# EAGLE board jb-main (EAGLE 4.15), part 1 of 2
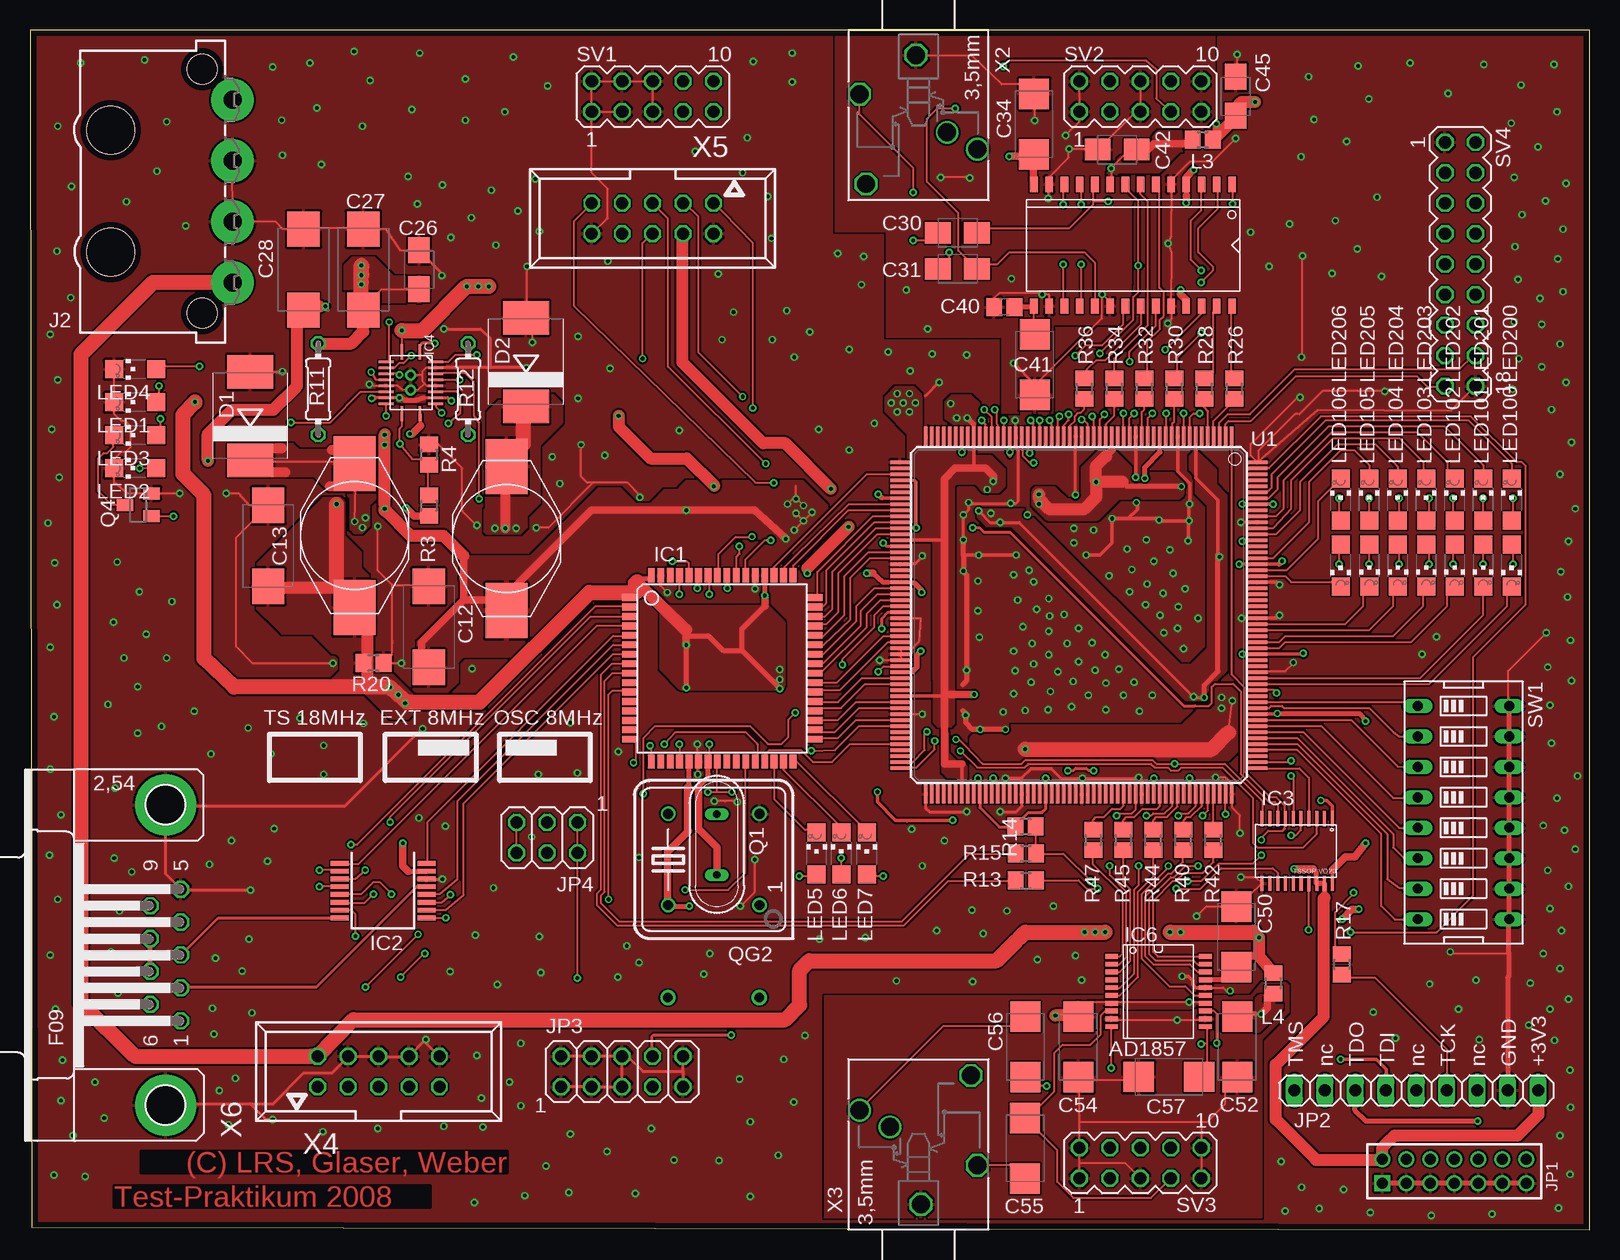
[diagram p7: board, top side]
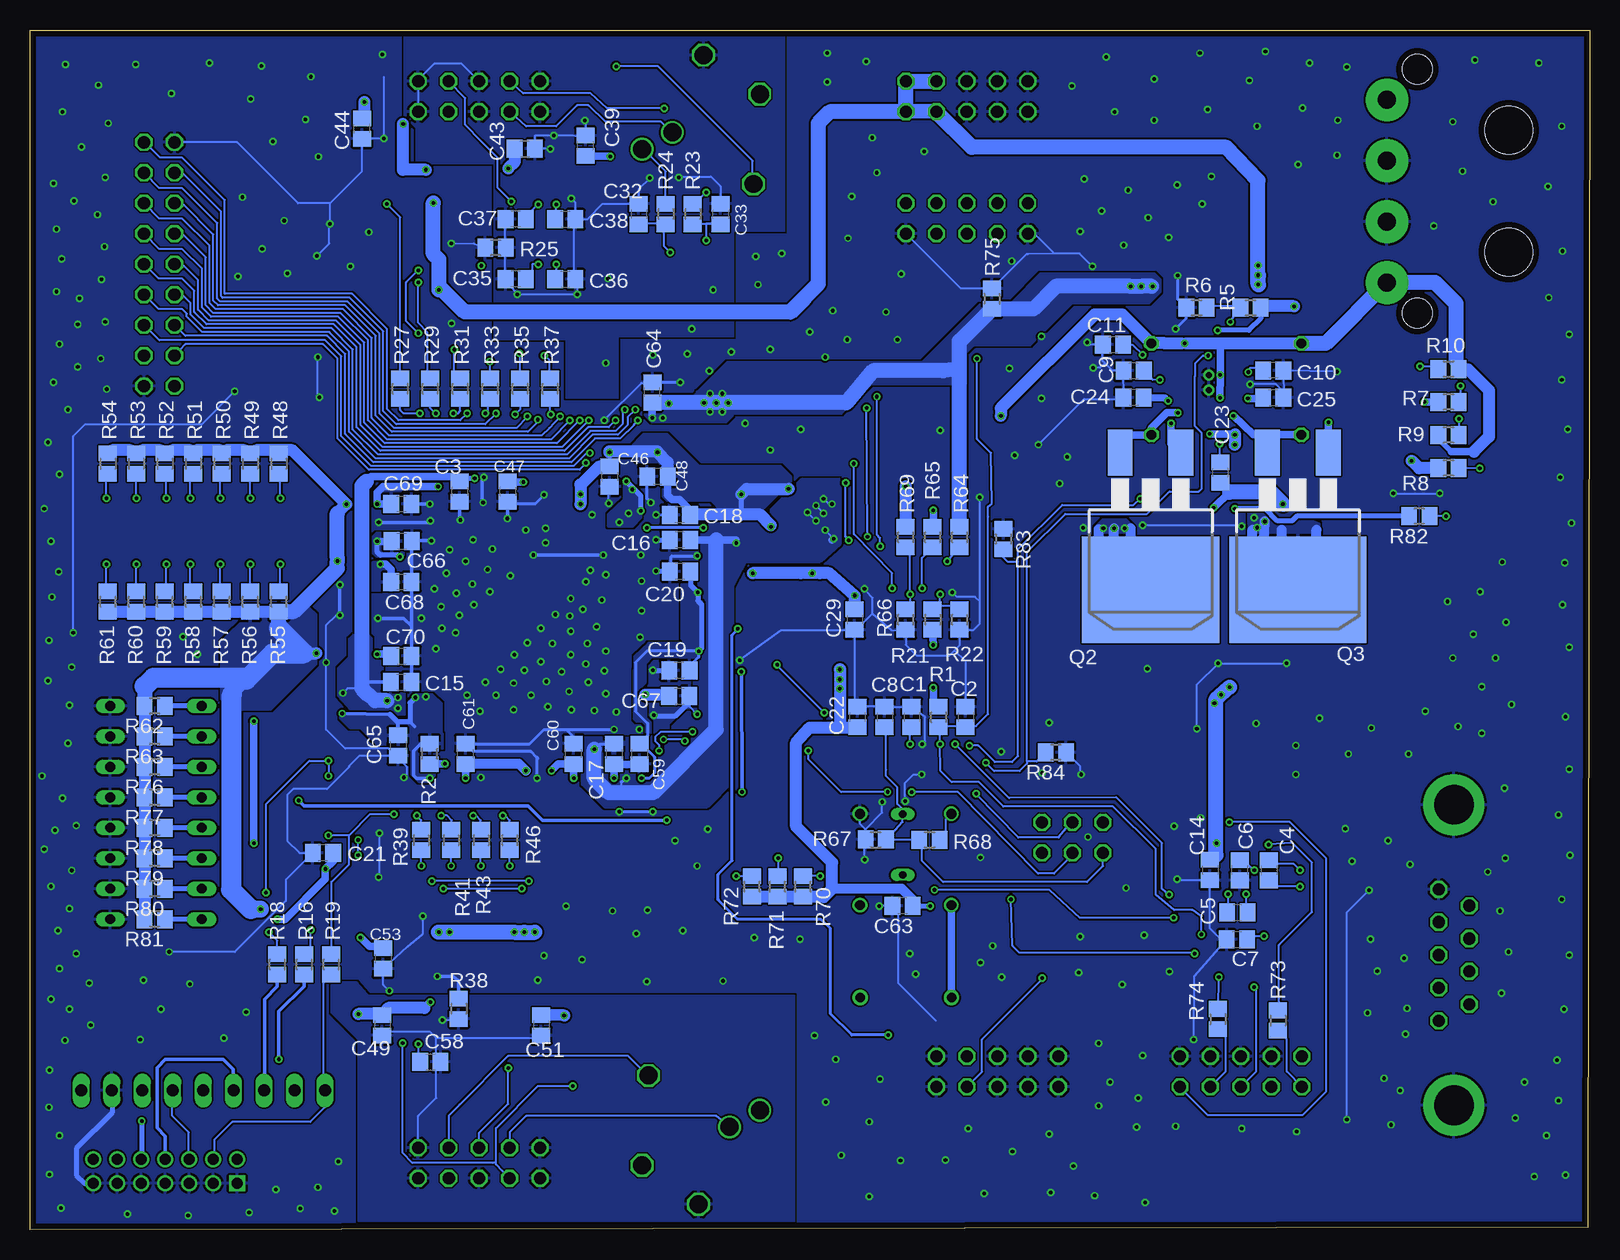
[diagram p8: board, bottom side, seen from below]

Size 130 x 100 mm. Coordinates in mm from the lower left corner, seen from the top.
Outline: 0.13,0.19 130,0 130,100 0,100 0.13,0.19
Copper layers (1*16): Top 0.035mm / dielectric 1.5mm / Bottom 0.035mm
Design rules "PCB-POOL": minimum track width 6mil, minimum drill 12mil, track to track 6mil, track to pad 6mil, pad to pad 6mil, via to via 6mil, smd to smd 6mil, copper to edge 20mil, drill to drill 8mil, minimum pad ring 8mil, minimum via ring 6mil, stop-mask expansion 3mil, vias tented up to drill 12mil, thermal gap 8mil

## Footprints (pad centres in the part's own frame; a part is rotated, then mirrored left to right if it is on the bottom)
C0805 = smd 1.3 x 1.5: 1 -0.85,0; 2 0.85,0
D/7343-31W = smd 2.95 x 2.7: + 3.375,0; - -3.375,0
B/3528-21W = smd 2.15 x 1.8: + 1.625,0; - -1.625,0
C/6032-28R = smd 2.55 x 2.5: + 2.525,0; - -2.525,0
SMC = smd 2.8 x 3.8: A 3.7,0; C -3.7,0
TQFP64 = smd 1.194 x 0.559: 1 -7.76,5.905; 2 -7.76,5.118; 3 -7.76,4.331; 4 -7.76,3.543; 5 -7.76,2.756; 6 -7.76,1.968; 7 -7.76,1.181; 8 -7.76,0.394; 9 -7.76,-0.394; 10 -7.76,-1.181; 11 -7.76,-1.968; 12 -7.76,-2.756; 13 -7.76,-3.543; 14 -7.76,-4.331; 15 -7.76,-5.118; 16 -7.76,-5.905; 33 7.76,-5.905; 34 7.76,-5.118; 35 7.76,-4.331; 36 7.76,-3.543; 37 7.76,-2.756; 38 7.76,-1.968; 39 7.76,-1.181; 40 7.76,-0.394; 41 7.76,0.394; 42 7.76,1.181; 43 7.76,1.968; 44 7.76,2.756; 45 7.76,3.543; 46 7.76,4.331; 47 7.76,5.118; 48 7.76,5.905 | smd 0.559 x 1.194: 17 -5.905,-7.76; 18 -5.118,-7.76; 19 -4.331,-7.76; 20 -3.543,-7.76; 21 -2.756,-7.76; 22 -1.968,-7.76; 23 -1.181,-7.76; 24 -0.394,-7.76; 25 0.394,-7.76; 26 1.181,-7.76; 27 1.968,-7.76; 28 2.756,-7.76; 29 3.543,-7.76; 30 4.331,-7.76; 31 5.118,-7.76; 32 5.905,-7.76; 49 5.905,7.76; 50 5.118,7.76; 51 4.331,7.76; 52 3.543,7.76; 53 2.756,7.76; 54 1.968,7.76; 55 1.181,7.76; 56 0.394,7.76; 57 -0.394,7.76; 58 -1.181,7.76; 59 -1.968,7.76; 60 -2.756,7.76; 61 -3.543,7.76; 62 -4.331,7.76; 63 -5.118,7.76; 64 -5.905,7.76
SSOP16 = smd 0.4 x 1.5: 1 -2.275,-3.625; 2 -1.625,-3.625; 3 -0.975,-3.625; 4 -0.325,-3.625; 5 0.325,-3.625; 6 0.975,-3.625; 7 1.625,-3.625; 8 2.275,-3.625; 9 2.275,3.625; 10 1.625,3.625; 11 0.975,3.625; 12 0.325,3.625; 13 -0.325,3.625; 14 -0.975,3.625; 15 -1.625,3.625; 16 -2.275,3.625
VO20 = smd 0.254 x 1.27: 1 2.928,2.701; 2 2.276,2.7; 3 1.626,2.7; 4 0.977,2.701; 5 0.325,2.7; 6 -0.325,2.7; 7 -0.975,2.7; 8 -1.626,2.7; 9 -2.276,2.7; 10 -2.926,2.7; 11 -2.928,-2.7; 12 -2.28,-2.7; 13 -1.623,-2.7; 14 -0.975,-2.7; 15 -0.328,-2.7; 16 0.328,-2.7; 17 0.975,-2.71; 18 1.623,-2.7; 19 2.28,-2.7; 20 2.928,-2.7
R-PQFP-20 = smd 1.27 x 0.203: 1 -7.317,1.5; 10 -2.183,1.5; 11 -2.183,3; 20 -7.317,3 | smd 0.203 x 1.27: 2 -6.5,0.182; 3 -6,0.182; 4 -5.5,0.182; 5 -5,0.182; 6 -4.5,0.182; 7 -4,0.182; 8 -3.5,0.182; 9 -3,0.182; 12 -3,4.317; 13 -3.5,4.317; 14 -4,4.317; 15 -4.5,4.317; 16 -5,4.317; 17 -5.5,4.317; 18 -6,4.317; 19 -6.5,4.317 | drill 0.5 round: TGND1 -5.385,2.226; TGND2 -4.135,2.226
R-28 = smd 1.27 x 0.635: 1 -5.08,8.255; 2 -5.08,6.985; 3 -5.08,5.715; 4 -5.08,4.445; 5 -5.08,3.175; 6 -5.08,1.905; 7 -5.08,0.635; 8 -5.08,-0.635; 9 -5.08,-1.905; 10 -5.08,-3.175; 11 -5.08,-4.445; 12 -5.08,-5.715; 13 -5.08,-6.985; 14 -5.08,-8.255; 15 5.08,-8.255; 16 5.08,-6.985; 17 5.08,-5.715; 18 5.08,-4.445; 19 5.08,-3.175; 20 5.08,-1.905; 21 5.08,-0.635; 22 5.08,0.635; 23 5.08,1.905; 24 5.08,3.175; 25 5.08,4.445; 26 5.08,5.715; 27 5.08,6.985; 28 5.08,8.255
RS-20 = smd 1.067 x 0.406: 1 -3.901,2.926; 2 -3.901,2.276; 3 -3.901,1.626; 4 -3.901,0.975; 5 -3.901,0.325; 6 -3.901,-0.325; 7 -3.901,-0.975; 8 -3.901,-1.626; 9 -3.901,-2.276; 10 -3.901,-2.926; 11 3.901,-2.926; 12 3.901,-2.276; 13 3.901,-1.626; 14 3.901,-0.975; 15 3.901,-0.325; 16 3.901,0.325; 17 3.901,0.975; 18 3.901,1.626; 19 3.901,2.276; 20 3.901,2.926
827001 = drill 1.5 pad 3.556 round: 1 -7.62,0; 2 -2.54,0; 3 2.54,0; 4 7.62,0 | hole 4: 5.08,-10.16; -5.08,-10.16 | hole 2.5: 10.16,-2.54; -10.16,-2.54
2X07M = drill 0.914 square: 1 -6,-1 | drill 0.914 round: 2 -6,1; 3 -4,-1; 4 -4,1; 5 -2,-1; 6 -2,1; 7 0,-1; 8 0,1; 9 2,-1; 10 2,1; 11 4,-1; 12 4,1; 13 6,-1; 14 6,1
1X09 = drill 1.016 long: 1 -10.16,0; 2 -7.62,0; 3 -5.08,0; 4 -2.54,0; 5 0,0; 6 2.54,0; 7 5.08,0; 8 7.62,0; 9 10.16,0
2X05 = drill 1.016 octagon: 1 -5.08,-1.27; 2 -5.08,1.27; 3 -2.54,-1.27; 4 -2.54,1.27; 5 0,-1.27; 6 0,1.27; 7 2.54,-1.27; 8 2.54,1.27; 9 5.08,-1.27; 10 5.08,1.27
2X03 = drill 1.016 octagon: 1 -2.54,-1.27; 2 -2.54,1.27; 3 0,-1.27; 4 0,1.27; 5 2.54,-1.27; 6 2.54,1.27
L-13X10 = smd 3.5 x 4.6: 1 0,6; 2 0,-6
R0805 = smd 1.3 x 1.5: 1 -0.85,0; 2 0.85,0
CHIPLED_1206 = smd 1.5 x 1.5: A 0,-1.75; C 0,1.75
QS = drill 0.61 long: 1 -2.54,0; 2 2.54,0
D2PACK = smd 2.083 x 3.81: 1 -2.54,-8.89; 3 2.54,-8.89 | smd 11.43 x 8.89: 2 0,2.54
SOT23 = smd 1 x 1.4: 1 -0.95,-1.1; 2 0.95,-1.1; 3 0,1.1
DIL08S = drill 0.813 round: 1 -3.81,-3.81; 4 3.81,-3.81; 5 3.81,3.81; 8 -3.81,3.81
0204/7 = drill 0.813 octagon: 1 -3.81,0; 2 3.81,0
MA05-2 = drill 1.016 octagon: 1 -5.08,-1.27; 2 -5.08,1.27; 3 -2.54,-1.27; 4 -2.54,1.27; 5 0,-1.27; 6 0,1.27; 7 2.54,-1.27; 8 2.54,1.27; 9 5.08,-1.27; 10 5.08,1.27
MA09-2 = drill 1.016 octagon: 1 -10.16,-1.27; 2 -10.16,1.27; 3 -7.62,-1.27; 4 -7.62,1.27; 5 -5.08,-1.27; 6 -5.08,1.27; 7 -2.54,-1.27; 8 -2.54,1.27; 9 0,-1.27; 10 0,1.27; 11 2.54,-1.27; 12 2.54,1.27; 13 5.08,-1.27; 14 5.08,1.27; 15 7.62,-1.27; 16 7.62,1.27; 17 10.16,-1.27; 18 10.16,1.27
EDG-08 = drill 0.813 long: 1 -8.89,-3.81; 2 -6.35,-3.81; 3 -3.81,-3.81; 4 -1.27,-3.81; 5 1.27,-3.81; 6 3.81,-3.81; 7 6.35,-3.81; 8 8.89,-3.81; 9 8.89,3.81; 10 6.35,3.81; 11 3.81,3.81; 12 1.27,3.81; 13 -1.27,3.81; 14 -3.81,3.81; 15 -6.35,3.81; 16 -8.89,3.81
PQ208 = smd 1.6 x 0.3: P1 -14.9,12.75; P2 -14.9,12.25; P3 -14.9,11.75; P4 -14.9,11.25; P5 -14.9,10.75; P6 -14.9,10.25; P7 -14.9,9.75; P8 -14.9,9.25; P9 -14.9,8.75; P10 -14.9,8.25; P11 -14.9,7.75; P12 -14.9,7.25; P13 -14.9,6.75; P14 -14.9,6.25; P15 -14.9,5.75; P16 -14.9,5.25; P17 -14.9,4.75; P18 -14.9,4.25; P19 -14.9,3.75; P20 -14.9,3.25; P21 -14.9,2.75; P22 -14.9,2.25; P23 -14.9,1.75; P24 -14.9,1.25; P25 -14.9,0.75; P26 -14.9,0.25; P27 -14.9,-0.25; P28 -14.9,-0.75; P29 -14.9,-1.25; P30 -14.9,-1.75; P31 -14.9,-2.25; P32 -14.9,-2.75; P33 -14.9,-3.25; P34 -14.9,-3.75; P35 -14.9,-4.25; P36 -14.9,-4.75; P37 -14.9,-5.25; P38 -14.9,-5.75; P39 -14.9,-6.25; P40 -14.9,-6.75; P41 -14.9,-7.25; P42 -14.9,-7.75; P43 -14.9,-8.25; P44 -14.9,-8.75; P45 -14.9,-9.25; P46 -14.9,-9.75; P47 -14.9,-10.25; P48 -14.9,-10.75; P49 -14.9,-11.25; P50 -14.9,-11.75; P51 -14.9,-12.25; P52 -14.9,-12.75; P105 14.9,-12.75; P106 14.9,-12.25; P107 14.9,-11.75; P108 14.9,-11.25; P109 14.9,-10.75; P110 14.9,-10.25; P111 14.9,-9.75; P112 14.9,-9.25; P113 14.9,-8.75; P114 14.9,-8.25; P115 14.9,-7.75; P116 14.9,-7.25; P117 14.9,-6.75; P118 14.9,-6.25; P119 14.9,-5.75; P120 14.9,-5.25; P121 14.9,-4.75; P122 14.9,-4.25; P123 14.9,-3.75; P124 14.9,-3.25; P125 14.9,-2.75; P126 14.9,-2.25; P127 14.9,-1.75; P128 14.9,-1.25; P129 14.9,-0.75; P130 14.9,-0.25; P131 14.9,0.25; P132 14.9,0.75; P133 14.9,1.25; P134 14.9,1.75; P135 14.9,2.25; P136 14.9,2.75; P137 14.9,3.25; P138 14.9,3.75; P139 14.9,4.25; P140 14.9,4.75; P141 14.9,5.25; P142 14.9,5.75; P143 14.9,6.25; P144 14.9,6.75; P145 14.9,7.25; P146 14.9,7.75; P147 14.9,8.25; P148 14.9,8.75; P149 14.9,9.25; P150 14.9,9.75; P151 14.9,10.25; P152 14.9,10.75; P153 14.9,11.25; P154 14.9,11.75; P155 14.9,12.25; P156 14.9,12.75 | smd 0.3 x 1.6: P53 -12.75,-14.9; P54 -12.25,-14.9; P55 -11.75,-14.9; P56 -11.25,-14.9; P57 -10.75,-14.9; P58 -10.25,-14.9; P59 -9.75,-14.9; P60 -9.25,-14.9; P61 -8.75,-14.9; P62 -8.25,-14.9; P63 -7.75,-14.9; P64 -7.25,-14.9; P65 -6.75,-14.9; P66 -6.25,-14.9; P67 -5.75,-14.9; P68 -5.25,-14.9; P69 -4.75,-14.9; P70 -4.25,-14.9; P71 -3.75,-14.9; P72 -3.25,-14.9; P73 -2.75,-14.9; P74 -2.25,-14.9; P75 -1.75,-14.9; P76 -1.25,-14.9; P77 -0.75,-14.9; P78 -0.25,-14.9; P79 0.25,-14.9; P80 0.75,-14.9; P81 1.25,-14.9; P82 1.75,-14.9; P83 2.25,-14.9; P84 2.75,-14.9; P85 3.25,-14.9; P86 3.75,-14.9; P87 4.25,-14.9; P88 4.75,-14.9; P89 5.25,-14.9; P90 5.75,-14.9; P91 6.25,-14.9; P92 6.75,-14.9; P93 7.25,-14.9; P94 7.75,-14.9; P95 8.25,-14.9; P96 8.75,-14.9; P97 9.25,-14.9; P98 9.75,-14.9; P99 10.25,-14.9; P100 10.75,-14.9; P101 11.25,-14.9; P102 11.75,-14.9; P103 12.25,-14.9; P104 12.75,-14.9; P157 12.75,14.9; P158 12.25,14.9; P159 11.75,14.9; P160 11.25,14.9; P161 10.75,14.9; P162 10.25,14.9; P163 9.75,14.9; P164 9.25,14.9; P165 8.75,14.9; P166 8.25,14.9; P167 7.75,14.9; P168 7.25,14.9; P169 6.75,14.9; P170 6.25,14.9; P171 5.75,14.9; P172 5.25,14.9; P173 4.75,14.9; P174 4.25,14.9; P175 3.75,14.9; P176 3.25,14.9; P177 2.75,14.9; P178 2.25,14.9; P179 1.75,14.9; P180 1.25,14.9; P181 0.75,14.9; P182 0.25,14.9; P183 -0.25,14.9; P184 -0.75,14.9; P185 -1.25,14.9; P186 -1.75,14.9; P187 -2.25,14.9; P188 -2.75,14.9; P189 -3.25,14.9; P190 -3.75,14.9; P191 -4.25,14.9; P192 -4.75,14.9; P193 -5.25,14.9; P194 -5.75,14.9; P195 -6.25,14.9; P196 -6.75,14.9; P197 -7.25,14.9; P198 -7.75,14.9; P199 -8.25,14.9; P200 -8.75,14.9; P201 -9.25,14.9; P202 -9.75,14.9; P203 -10.25,14.9; P204 -10.75,14.9; P205 -11.25,14.9; P206 -11.75,14.9; P207 -12.25,14.9; P208 -12.75,14.9
PG203J = drill 1.499 octagon: 1 -5.004,-0.203; 4 5.74,-4.369; 5 -1.753,-4.902 | drill 1.499 round: 2 2.845,4.902; 3 1.448,2.388
057-010-1 = drill 1 octagon: 1 -5.08,-1.27; 2 -5.08,1.27; 3 -2.54,-1.27; 4 -2.54,1.27; 5 0,-1.27; 6 0,1.27; 7 2.54,-1.27; 8 2.54,1.27; 9 5.08,-1.27; 10 5.08,1.27
F09HP = drill 1.016 octagon: 1 -5.486,-1.27; 2 -2.743,-1.27; 3 0,-1.27; 4 2.743,-1.27; 5 5.486,-1.27; 6 -4.115,1.27; 7 -1.372,1.27; 8 1.372,1.27; 9 4.115,1.27 | drill 3.302 pad 5.08 round: G1 -12.522,0; G2 12.522,0

## Placement (x,y rotation side)
C1  15p  [C0805]  56.5,42.72 270 bottom
C2  100n  [C0805]  52,42.72 270 bottom
C3  100n  [C0805]  94.19,61.52 270 bottom
C4  100n  [C0805]  26.72,29.95 270 bottom
C5  100n  [C0805]  29.36,26.44 0 bottom
C6  100n  [C0805]  29.16,29.95 90 bottom
C7  100n  [C0805]  29.4,24.18 0 bottom
C8  15p  [C0805]  58.75,42.72 270 bottom
C9  1n5  [C0805]  38,71.6 0 bottom
C10  1n5  [C0805]  26.37,71.62 180 bottom
C11  10n  [C0805]  39.71,73.76 0 bottom
C12  100u  [D/7343-31W]  33.25,50.23 270 top
C13  100u  [D/7343-31W]  19.86,56.98 270 top
C14  100n  [C0805]  31.63,29.97 270 bottom
C15  100n  [C0805]  99.07,45.66 0 bottom
C16  100n  [C0805]  75.82,57.47 180 bottom
C17  100n  [C0805]  81.32,39.66 270 bottom
C18  100n  [C0805]  75.83,59.57 180 bottom
C19  100n  [C0805]  75.87,46.62 180 bottom
C20  100n  [C0805]  75.81,54.86 180 bottom
C21  100n  [C0805]  105.58,31.4 180 bottom
C22  100n  [C0805]  61,42.72 90 bottom
C23  10p  [C0805]  30.75,63.09 90 bottom
C24  100n  [C0805]  38,69.34 180 bottom
C25  100n  [C0805]  26.37,69.37 0 bottom
C26  1u  [B/3528-21W]  32.42,80.03 270 top
C27  100u  [D/7343-31W]  27.79,80.03 270 top
C28  10u  [D/7343-31W]  22.8,80.03 270 top
C29  100n  [C0805]  61.25,50.84 270 bottom
C30  1u  [B/3528-21W]  77.32,83.09 0 top
C31  1u  [B/3528-21W]  77.32,80.09 0 top
C32  2n2  [C0805]  79.25,84.66 270 bottom
C33  2n2  [C0805]  72.44,84.66 270 bottom
C34  4u7  [C/6032-28R]  83.69,92.16 270 top
C35  470p  [C0805]  89.5,79.22 180 bottom
C36  470p  [C0805]  85.38,79.22 0 bottom
C37  470p  [C0805]  89.5,84.22 180 bottom
C38  470p  [C0805]  85.38,84.22 0 bottom
C39  100n  [C0805]  83.69,90.34 90 bottom
C40  100n  [C0805]  81.21,76.89 180 top
C41  4u7  [C/6032-28R]  83.75,72.09 90 top
C42  1u  [B/3528-21W]  90.63,90.03 0 top
C43  100n  [C0805]  88.75,90.09 0 bottom
C44  10n  [C0805]  102.32,91.78 90 bottom
C45  1u  [B/3528-21W]  100.5,94.47 270 top
C46  100n  [C0805]  81.69,62.78 270 bottom
C47  100n  [C0805]  90.19,61.52 270 bottom
C48  100n  [C0805]  77.69,62.78 180 bottom
C49  100n  [C0805]  100.63,17.03 270 bottom
C50  4u7  [C/6032-28R]  100.57,24.41 270 top
C51  100n  [C0805]  87.38,17.03 270 bottom
C52  4u7  [C/6032-28R]  100.63,15.22 90 top
C53  10n  [C0805]  100.57,22.59 270 bottom
C54  4u7  [C/6032-28R]  87.38,15.22 90 top
C55  4u7  [C/6032-28R]  82.95,6.76 90 top
C56  4u7  [C/6032-28R]  82.98,15.24 270 top
C57  4u7  [C/6032-28R]  94.94,12.72 0 top
C58  100n  [C0805]  96.63,13.97 0 bottom
C59  100n  [C0805]  79.19,39.66 270 bottom
C60  100n  [C0805]  84.69,39.66 90 bottom
C61  100n  [C0805]  93.69,39.66 90 bottom
C63  100n  [C0805]  57.25,26.97 180 bottom
C64  100n  [C0805]  78.12,69.79 90 bottom
C65  100n  [C0805]  99.32,40.34 270 bottom
C66  100n  [C0805]  99,57.41 0 bottom
C67  100n  [C0805]  75.88,44.47 0 bottom
C68  100n  [C0805]  99.04,53.99 0 bottom
C69  100n  [C0805]  99.04,60.5 0 bottom
C70  100n  [C0805]  99.04,47.82 0 bottom
D1  MBRS340T3  [SMC]  18.36,67.81 90 top
D2  MBRS340T3  [SMC]  41.35,72.31 90 top
IC1  MEGA64-A  [TQFP64]  57.69,46.77 0 top
IC2  MAX3221CAE  [SSOP16]  29.42,28.25 270 top
IC3  XCF04S-VO20  [VO20]  105.63,31.54 0 top
IC4  TPS75003  [R-PQFP-20]  29.5,65.84 270 top
IC5  AD1870SOL-28  [R-28]  91.94,82.05 270 top
IC6  AD1857  [RS-20]  94.07,19.84 0 top
J2  [827001]  16.89,86.56 270 top
JP1  [2X07M]  118.73,4.86 0 top
JP2  JTAG FPGA  [1X09]  115.56,11.6 0 top
JP3  [2X05]  49.36,13.17 0 top
JP4  [2X03]  43.11,32.66 180 top
L1  15u  [L-13X10]  39.71,57.59 0 top
L2  L-13X10  [L-13X10]  27.05,57.84 0 top
L3  1u  [R0805]  97.75,90.84 0 top
L4  1u  [R0805]  103.63,20.53 270 top
LED1  +3V3  [CHIPLED_1206]  8.75,68.97 90 top
LED2  +2V5  [CHIPLED_1206]  8.75,63.47 90 top
LED3  +1V8  [CHIPLED_1206]  8.75,66.22 90 top
LED4  +5V0  [CHIPLED_1206]  8.75,71.72 90 top
LED5  GRÜN  [CHIPLED_1206]  65.57,31.34 0 top
LED6  GELB  [CHIPLED_1206]  67.63,31.34 0 top
LED7  ROT  [CHIPLED_1206]  69.75,31.34 0 top
LED100  ROT  [CHIPLED_1206]  123.5,55.34 180 top
LED101  GELB  [CHIPLED_1206]  121.13,55.37 180 top
LED102  GELB  [CHIPLED_1206]  118.76,55.37 180 top
LED103  GRÜN  [CHIPLED_1206]  116.39,55.37 180 top
LED104  GRÜN  [CHIPLED_1206]  114.03,55.37 180 top
LED105  GRÜN  [CHIPLED_1206]  111.66,55.37 180 top
LED106  GRÜN  [CHIPLED_1206]  109.25,55.34 180 top
LED200  ROT  [CHIPLED_1206]  123.5,60.84 0 top
LED201  GELB  [CHIPLED_1206]  121.13,60.84 0 top
LED202  GELB  [CHIPLED_1206]  118.75,60.84 0 top
LED203  GRÜN  [CHIPLED_1206]  116.38,60.84 0 top
LED204  GRÜN  [CHIPLED_1206]  114,60.84 0 top
LED205  GRÜN  [CHIPLED_1206]  111.63,60.84 0 top
LED206  GRÜN  [CHIPLED_1206]  109.25,60.84 0 top
Q1  <=8MHz  [QS]  57.25,32.09 270 top
Q2  IRFR5305  [D2PACK]  36.58,55.88 180 bottom
Q3  IRFR5305  [D2PACK]  24.3,55.88 180 bottom
Q4  BC847ASMD  [SOT23]  9.02,60.41 90 top
QG2  <=8MHz  [DIL08S]  57,30.84 90 top
R1  10k  [R0805]  54.25,42.72 90 bottom
R2  330  [R0805]  96.69,39.66 90 bottom
R3  56k  [R0805]  33.25,60.34 270 top
R4  33k  [R0805]  33.25,64.59 270 top
R5  39k  [R0805]  28.25,76.84 0 bottom
R6  10k  [R0805]  32.75,76.84 0 bottom
R7  150  [R0805]  11.75,68.97 180 bottom
R8  100  [R0805]  11.75,63.47 180 bottom
R9  220  [R0805]  11.75,66.22 180 bottom
R10  220  [R0805]  11.75,71.72 0 bottom
R11  33m  [0204/7]  24.03,70.06 90 top
R12  33m  [0204/7]  36.52,70.06 90 top
R13  100  [R0805]  83.02,29.09 0 top
R14  100  [R0805]  83.02,31.34 0 top
R15  4k7  [R0805]  82.99,33.59 180 top
R16  30  [R0805]  107.13,22.09 90 bottom
R17  30  [R0805]  109.37,22.11 90 top
R18  30  [R0805]  109.38,22.09 90 bottom
R19  30  [R0805]  104.88,22.09 90 bottom
R20  47  [R0805]  28.63,47.22 180 top
R21  1k  [R0805]  54.75,50.84 270 bottom
R22  3k3  [R0805]  52.5,50.84 90 bottom
R23  330  [R0805]  74.75,84.66 270 bottom
R24  330  [R0805]  77,84.66 270 bottom
R25  0  [R0805]  91.19,81.84 180 bottom
R26  4k7  [R0805]  100.38,70.09 270 top
R27  4k7  [R0805]  99.13,70.09 90 bottom
R28  4k7  [R0805]  97.88,70.09 270 top
R29  4k7  [R0805]  96.63,70.09 90 bottom
R30  4k7  [R0805]  95.38,70.09 270 top
R31  4k7  [R0805]  94.13,70.09 90 bottom
R32  4k7  [R0805]  92.88,70.09 270 top
R33  4k7  [R0805]  91.63,70.09 90 bottom
R34  4k7  [R0805]  90.38,70.09 270 top
R35  4k7  [R0805]  89.13,70.09 90 bottom
R36  4k7  [R0805]  87.88,70.09 270 top
R37  4k7  [R0805]  86.63,70.09 90 bottom
R38  0  [R0805]  94.25,18.41 270 bottom
R39  4k7  [R0805]  97.38,32.47 270 bottom
R40  4k7  [R0805]  96.13,32.47 90 top
R41  4k7  [R0805]  94.88,32.47 270 bottom
R42  4k7  [R0805]  98.63,32.47 90 top
R43  4k7  [R0805]  92.38,32.47 270 bottom
R44  4k7  [R0805]  93.63,32.47 90 top
R45  4k7  [R0805]  91.13,32.47 270 top
R46  4k7  [R0805]  90,32.47 90 bottom
R47  4k7  [R0805]  88.63,32.47 270 top
R48  100  [R0805]  109.25,63.84 270 bottom
R49  100  [R0805]  111.63,63.84 270 bottom
R50  100  [R0805]  114,63.84 270 bottom
R51  100  [R0805]  116.38,63.84 270 bottom
R52  100  [R0805]  118.75,63.84 270 bottom
R53  100  [R0805]  121.13,63.84 270 bottom
R54  150  [R0805]  123.5,63.84 270 bottom
R55  100  [R0805]  109.25,52.34 90 bottom
R56  100  [R0805]  111.63,52.34 90 bottom
R57  100  [R0805]  114,52.34 90 bottom
R58  100  [R0805]  116.38,52.34 90 bottom
R59  100  [R0805]  118.75,52.34 90 bottom
R60  100  [R0805]  121.13,52.34 90 bottom
R61  150  [R0805]  123.5,52.34 90 bottom
R62  4k7  [R0805]  119.6,43.65 180 bottom
R63  4k7  [R0805]  119.6,41.11 180 bottom
R64  4k7  [R0805]  52.5,57.72 90 bottom
R65  4k7  [R0805]  54.75,57.72 90 bottom
R66  4k7  [R0805]  57,50.84 90 bottom
R67  1k  [R0805]  59.5,32.51 0 bottom
R68  560  [R0805]  55.01,32.5 0 bottom
R69  4k7  [R0805]  57,57.72 90 bottom
R70  100  [R0805]  65.57,28.59 90 bottom
R71  100  [R0805]  67.69,28.59 90 bottom
R72  150  [R0805]  69.82,28.59 90 bottom
R73  1k  [R0805]  25.97,17.42 270 bottom
R74  1k  [R0805]  30.97,17.55 270 bottom
R75  22  [R0805]  49.82,77.59 270 bottom
R76  4k7  [R0805]  119.6,38.57 180 bottom
R77  4k7  [R0805]  119.6,36.03 180 bottom
R78  4k7  [R0805]  119.6,33.49 180 bottom
R79  4k7  [R0805]  119.6,30.95 180 bottom
R80  4k7  [R0805]  119.6,28.41 180 bottom
R81  4k7  [R0805]  119.6,25.87 180 bottom
R82  4k7  [R0805]  14.19,59.46 180 bottom
R83  4k7  [R0805]  48.86,57.56 270 bottom
R84  4k7  [R0805]  44.48,39.78 180 bottom
SV1  [MA05-2]  51.91,94.45 0 top
SV2  [MA05-2]  92.55,94.45 0 top
SV3  [MA05-2]  92.55,5.55 0 top
SV4  [MA09-2]  119.23,80.47 270 top
SW1  [EDG-08]  119.5,34.76 270 top
U1  XC3S500EPQ208  [PQ208]  87.43,51.22 270 top
X2  PG203J  [PG203J]  74.07,92.91 270 top
X3  PG203J  [PG203J]  74.07,7.09 90 top
X4  SPI uC  [057-010-1]  29.05,13.16 0 top
X5  JTAG uC  [057-010-1]  51.91,84.29 180 top
X6  [F09HP]  11.3,22.88 90 top

## Tracks (layer width: path | path; a pad name or v marks a point on that pad's centre or on a via)
+3V3  (via drill 0.3, 0.3 pad 0.61, 0.8 pad 1.27)
  Top 0.152: 28.13,47.47 R20.2 28.13,46.97 | 28.13,49.97 L2.2 25.67,53.42 25.63,53.47 | 21.13,53.47 C13.+ | R3.2 33.11,59.65 | IC1.21 54.88,38.34 | 50.13,52.72 IC1.1 | 61.25,54.09 IC1.52 | 50.51,54.09 50.38,54.27 | 51.77,54.27 IC1.64 | IC3.18 107.22,28.88 | 90.2,64.99 90.2,65.05 | 72.61,60.99 72.61,60.97 U1.P59 | IC3.19 | 113.19,7.33 113.2,7.31 | U1.P88 72.56,46.44 | U1.P73 72.62,54.06 | U1.P176 | U1.P21 90.2,66.1 | v93.69,37.62 93.68,37.6 | 103.63,60.45 103.66,60.41 | v103.63,60.47 103.63,60.45 | U1.P201 103.6,60.48 103.63,60.45 | v30.7,44.59 30.7,44.73 v31.28,43.89
  Top 0.254: 82.14,33.62 82.14,33.61 R15.2 | 82.14,33.62 82.07,33.55 80.8,33.55 79.18,35.18 U1.P114 79.18,37.46 v79.02,37.62 | U1.P125 | 72.52,60.99 72.36,60.99 | 72.52,60.99 U1.P59 72.55,60.99 72.52,60.99 | U1.P125 v84.68,37.62 | 82.14,33.62 82.14,33.68 83.21,34.76 84.36,34.76 84.68,35.08 84.68,36.28 84.68,36.29 U1.P125 | 88.68,38.19 v88.68,38.25 88.23,38.25 88.04,38.44 87.15,38.44 86.96,38.25 v86.52,38.25 | U1.P88 72.57,46.51 | 74.32,53.3 v74.32,53.11 | 72.61,53.94 72.58,53.97 U1.P73 | U1.P46 v77.68,64.81 v77.69,64.8 | 112.74,5.8 112.73,5.81 JP1.2 | v106.14,48.03 106.14,47.97 | v105.38,30.06 105.31,30.06 | QG2.8 53.28,26.95
  Top 0.305: v103.63,60.47 U1.P201 | 104.14,55.48 103.31,55.48 U1.P191 v100.81,55.46 | 71.54,53.97 U1.P73 | U1.P201 v101.06,60.48 | U1.P38 81.68,64.49 v81.69,64.8 | U1.P176 v101.06,47.97 | 93.68,37.6 U1.P143 | 72.61,53.94 73.69,53.94 | 71.02,60.99 72.55,60.99 | U1.P21 90.2,66.13 90.2,65.05 | 106.14,47.97 U1.P176 | IC3.19 arc90 IC3.19 | 107.92,27.65 arc90 108.11,27.46 | U1.P88 72.55,46.45 72.55,46.44 73.5,46.44 73.56,46.51
  Top 0.406: 50.51,54.09 50.13,53.97 | v54.7,48.73 v54.7,45.17 | 50.38,54.27 51.77,54.27 | v104.39,55.72 104.14,55.48 | IC3.19 107.51,28.84 IC3.18 | 61.25,54.09 v61.25,52.85 61.19,52.85 61.18,52.86 | 70.28,54.72 71.12,53.97 71.54,53.97 | 73.69,53.94 74.32,53.3 | v74.26,48.22 73.94,47.9 73.94,46.89 73.56,46.51 | v70.71,61.3 71.02,60.99 | v95.98,61.94 91.47,61.94 91.09,62.32 | 107.22,28.88 107.22,29.81 106.96,30.06 | 33.22,59.46 R3.2 | 54.7,49.49 56.55,49.49 57.75,48.29 59.34,48.29 | 62.53,45.09 62.58,45.05 | 62.53,45.09 v62.5,45.09 | 59.34,48.29 62.34,45.29 | 62.34,45.29 62.53,45.09 | 59.34,48.29 59.34,50.06 61.18,51.91 61.18,52.86 | 61.18,52.86 61.12,52.92 | 107.92,27.65 IC3.19 | 62.34,45.29 62.39,45.24 | IC1.21 54.96,39 54.96,36.98 54.83,36.86 | 53.28,26.95 v54.96,26.95 | IC2.15 31.53,29.87
  Top 0.61: v30,45.22 28.13,45.22 | QG2.8 53.13,27.47 53.13,31.47 54.88,33.22 54.83,33.27 54.83,36.86 | 50.13,53.97 50.13,52.72 | 54.7,50 54.7,49.49 v54.7,48.73 | v61.25,52.85 61.25,51.99 | v69.75,54.72 70.28,54.72 | 54.39,83.02 X5.4 | 54.51,72.16 54.39,72.29 | v64.8,54.7 64.8,55.14 | v109.38,25.87 110.2,26.7 v110.77,26.7 | 106.96,30.06 v105.38,30.06 | v31.34,60.16 32.03,59.46 33.22,59.46 | 89.69,64.48 90.2,64.99 | 31.53,29.87 31.08,30.31 v31.08,32.22
  Top 1.016: 28.13,47.47 28.13,49.97 | 25.63,53.47 21.13,53.47 | 28.13,45.22 28.13,46.97 | JP2.9 125.75,10.72 125.75,9.6 124,7.84 113.75,7.84 113.2,7.31 112.73,6.86 JP1.2 | 54.7,50 50.62,53.98 50.51,54.09 | v66.77,61.75 62.96,65.56 61.12,65.56 54.51,72.16 | 54.39,72.29 54.39,83.02 | 64.8,55.14 v68.23,58.57 | v84.1,61.3 84.1,60.92 84.99,60.03 87.85,60.03 88.87,61.05 v88.87,62.32 | v88.87,62.32 88.87,63.65 89.69,64.48 | 91.09,62.32 v88.87,62.32 | 25.67,53.42 25.68,53.42 25.68,53.43 25.56,53.56 | 112.74,5.8 107.22,5.8 103.85,9.17 103.85,13.74 107.85,17.74 107.85,27.58 107.92,27.65
  Top 1.27: 25.56,53.56 v25.56,60.48 | 50.62,53.98 50.58,53.94 50.58,53.17 50.51,53.11 46.64,53.11 37.5,43.97 31.38,43.97 v30.7,44.59 v30,45.22 17,45.22 14.5,47.59 14.5,61.22 12.75,62.97 12.75,67.93 13.75,68.92 v13.75,68.99
  Bottom 0.152: 30,61.47 30.5,62.22 C23.1 | 56.5,27.59 56.63,26.97 C63.1 | C29.1 60.63,51.22 | 116.63,64.97 R51.1 116.13,64.97 | 118.13,64.97 R52.1 119.13,64.97 | 121.63,64.97 R53.1 120.63,64.97 | 123.13,64.97 R54.1 | 112.13,64.97 R49.1 111.13,64.97 | 113.63,64.97 R50.1 114.13,64.97 | 100.13,60.47 C69.1 | 118.13,51.47 R59.1 119.13,51.47 | 121.63,51.47 R60.1 120.63,51.47 | 123.13,51.47 R61.1 124.13,50.97 | R55.1 109.63,51.47 | 111.13,51.47 R56.1 112.13,51.47 | 113.63,51.47 R57.1 114.13,51.47 | 76.87,62.83 C48.1 | 104.68,31.52 104.68,31.45 C21.1 104.74,31.39 | C20.1 | 93.69,38.76 C61.1 93.69,38.82 | 109.63,64.97 109.13,64.47 R48.1 109.63,64.97
  Bottom 0.254: C19.1 75,46.63 74.96,46.63 74.96,47.02 74.26,47.71 v74.26,48.22 78.58,48.22 79.53,47.27 79.53,43.21 78.52,42.19 78.52,41.17 79.21,40.48 C59.1 | C18.1 74.77,59.78 | 74.96,59.59 C18.1 | v68.23,58.57 68.23,58.7 | 65.75,54.72 65.75,54.64 | 84.68,38.79 C60.1 | 93.82,38.82 93.8,38.81 C61.1 93.71,38.81 | 93.71,38.81 93.76,38.76 | 93.69,38.82 93.71,38.81 | 79.21,40.54 C59.1 | 74.9,54.83 74.92,54.83 C20.1 | 76.84,63.63 76.84,63.95 | C18.1 74.98,59.99 | 76.87,62.83 76.84,62.8 C48.1 | R55.1 | 64.16,54.72 64.16,54.7 v64.8,54.7 | C59.1 79.16,40.48 78.77,40.48 | v79.02,37.62 78.39,37.62 77.94,38.06 77.94,39.39 79.06,40.51 C59.1 | 56.42,26.95 56.42,26.96 C63.1
  Bottom 0.305: C69.1 101.04,60.5 v101.06,60.48 v101.05,60.47 | C46.1 81.69,63.65 v81.69,64.8 | 109.25,51.52 R55.1 | 100.04,47.97 C70.1 | 99.92,54 99.91,53.99 C68.1 | C47.1 90.64,61.94 | 120.55,25.68 120.45,25.78 R81.2 | 111.95,45.84 | 111.95,45.84 112.11,46
  Bottom 0.406: v31.08,32.22 31.08,31.2 C14.1 31.13,31.22 | R70.1 65.57,28.16 | 54.7,43.9 R1.2 | 62.5,41.84 C22.1 | 116.63,51.47 R58.1 116.35,51.47 | v104.39,55.72 104.38,55.97 | 90.2,62.64 C47.1 90.2,62.32 | 81.74,63.59 C46.1 81.71,63.63 81.75,63.59 | 74.9,54.83 74.9,53.68 v74.32,53.11 74.32,52.41 74.01,52.1 74.01,48.48 v74.26,48.22 | 99.85,54.06 99.89,54.02 C68.1 | 70.71,59.59 v70.71,61.3 | v54.96,26.95 56.42,26.95
  Bottom 0.61: v54.7,45.17 54.7,43.9 | v54.7,48.73 R21.2 | v95.98,61.94 100.55,61.94 101.06,61.43 v101.06,60.48 | v101.05,60.47 100.13,60.47 | v84.68,37.62 84.68,38.79 | v101.06,47.97 100.04,47.97 | 93.69,38.76 v93.69,37.62 | C60.1 85.96,38.81 v86.52,38.25 | 74.98,59.99 75.85,60.86 76.48,60.86 76.87,61.24 76.87,62.83 | v100.81,55.46 100.36,55.46 99.92,55.02 99.92,54 | v88.87,62.32 90.2,62.32 | v109.38,25.87 108.74,25.87 105.38,29.23 v105.38,30.06 104.74,30.7 104.74,31.39 | 30,61.47 v31.34,60.16 | QG2.8 53.18,27.02 v53.18,19.33 | v13.75,68.99 R7.2
  Bottom 0.813: 56.5,27.59 57.32,28.41 63.13,28.41 | v88.68,38.25 89.25,38.82 93.69,38.82
  Bottom 1.016: C29.1 v61.25,52.85 63.38,54.72 64.16,54.72 65.75,54.72 v69.75,54.72 | 63.16,30.62 63.13,30.59 | 63.16,30.62 66.13,33.59 66.13,40.59 65,41.84 62.5,41.84 | 62.5,41.84 61,41.84 | 116.63,64.97 118.13,64.97 | 121.63,64.97 123.13,64.97 | 119.13,64.97 120.63,64.97 | 112.13,64.97 113.63,64.97 | 111.13,64.97 109.63,64.97 108.13,64.97 v103.63,60.47 104.38,59.72 | 114.13,64.97 116.13,64.97 | 116.63,51.47 118.13,51.47 | 121.63,51.47 123.13,51.47 | 119.13,51.47 120.63,51.47 | 109.63,51.47 111.13,51.47 | 112.13,51.47 113.63,51.47 | 114.13,51.47 116.35,51.47 | v70.71,61.3 70.26,61.75 v66.77,61.75 | 74.96,59.59 70.71,59.59 69.12,59.59 68.23,58.7 | C48.1 76.84,63.63 | 76.84,63.95 v77.69,64.8 77.69,64.86 81.69,64.86 v81.69,64.8 | 107.16,48.03 v106.14,48.03 | 84.1,62.06 84.1,62.13 | 81.75,63.59 82.58,63.59 84.1,62.06 | 113.19,44.6 111.95,45.84 | 113.25,28.35 113.19,28.41 | 84.1,62.06 v84.1,60.48 | v62.5,46.68 62.49,46.7 62.45,46.7 62.45,41.9 62.5,41.84 | R72.1 69.82,27.71 67.73,27.71 R71.1 67.66,27.71 65.6,27.71 R70.1 65.56,27.71 63.83,27.71 63.13,28.41 63.15,28.43 63.15,30.63 63.16,30.62 | R62.2 R63.2 | R63.2 120.45,41.09 120.49,41.05 | R63.2 R76.2 | R76.2 120.45,38.55 120.49,38.51 | R76.2 120.45,36.07 120.49,36.03 R77.2 R78.2 | R78.2 120.45,33.46 120.49,33.43 | R78.2 R79.2 | R79.2 120.45,30.93 120.49,30.89 | R79.2 R80.2 | R80.2 120.45,28.31 120.43,28.28 | 120.45,25.83 R81.2 | R80.2 120.45,25.83 | 120.45,25.83 120.43,25.81
  Bottom 1.27: 31.13,31.22 31.13,44.22 v30,45.22 | 104.38,55.97 104.38,59.72 | v104.39,55.72 104.39,55.12 107.98,51.52 109.25,51.52 | 109.25,50.13 R55.1 | 30,61.47 26.55,61.47 v25.56,60.48 | 120.45,45.28 R62.2
  Bottom 1.422: v110.77,26.7 111.6,26.7
  Bottom 1.676: 109.25,50.13 107.16,48.03 109.76,48.03 111.95,45.84 | 113.19,28.41 113.19,44.6 | 111.6,26.7 113.25,28.35 | 120.45,45.28 119.73,46 112.11,46
  other vias: 62.5,45.86
  pour Top: 52.67,51.91 61.44,51.91 62.77,50.57 62.77,45.36 62.51,45.11 54.32,45.11 52.67,46.76
  pour Top: 83.66,61.43 83.66,60.48 84.87,59.27 88.93,59.27 90.71,61.05 95.72,61.05 96.04,61.37 96.04,62.13 95.22,62.95 92.17,62.95 90.71,64.41 90.39,64.73 89.12,64.73 87.79,63.4 87.79,61.18 87.34,60.73 86.39,60.73 85.37,61.75 83.85,61.75 83.72,61.62
  pour Bottom (isolate 0.152): 106.2,47.14 109.95,43.4 113.19,43.4 114.01,44.22 114.01,48.98 111.79,51.21 109.57,51.21 109,51.78 106.71,51.78 106.2,51.27
  pour Bottom (isolate 0.152, rank 3): 78.39,40.92 78.26,41.05 78.26,42.25 78.64,42.63 78.64,43.59 79.02,43.97 79.21,43.97 79.47,44.22 79.47,44.86 78.71,45.62 78.71,47.21 78.14,47.78 75.91,47.78 75.47,47.33 74.64,47.33 74.26,47.71 74.26,48.54 75.21,48.86 78.45,48.86 79.6,47.78 79.6,46.7 79.66,46.63 79.66,42.57 79.47,42.38 78.96,42.38 78.64,42.06 78.64,41.17
  pour Bottom: 66.58,62.76 67.4,63.59 74.2,63.59 76.87,66.26 78.9,66.26 80.04,65.11 80.04,64.67 79.41,64.03 77.63,64.03 77.25,63.65 77.25,61.11 76.93,60.8 73.25,60.8 72.42,59.97 68.99,59.97 66.58,62.38
  pour Bottom (isolate 0.152, rank 4): 75.53,49.11 75.66,49.24 75.66,51.21 75.66,53.81 75.47,54 75.09,54 74.52,53.43 74.26,53.17 74.26,52.54 73.94,52.22 73.94,48.54 74.96,48.54
  pour Bottom: 98.84,62 98.84,61.87 100.11,60.6 100.87,60.6 101.12,60.86 101.12,61.37 100.55,61.94
  pour Bottom: 99.28,54.13 99.28,53.49 99.47,53.3 101.57,53.3 101.76,53.49 101.76,55.21 101.38,55.59 100.3,55.59 100.11,55.4
  pour Top (isolate 0.152): 18.57,55.08 24.48,60.99 25.81,60.99 26.13,60.67 26.13,57.87 27.53,56.48 27.53,55.14 28.67,54 28.67,52.79 25.56,49.68 21.05,49.68 18.57,52.16
  pour Top (isolate 0.152): 23.72,49.62 25.24,48.09 25.56,48.09 25.94,47.71 25.94,46.51 24.99,45.55 24.99,45.24 27.46,45.24 30.07,42.63 31.46,42.63 31.78,42.95 31.78,44.67 28.48,47.97 28.48,49.87 23.97,49.87
+5V  (via drill 0.3, 0.3 pad 0.61)
  Top 0.152: 98.57,90.78 98.6,90.82 L3.2 98.9,91.15 | 100.5,92.72 C45.+ | 96.39,87.11 96.44,87.16 | 96.38,86.21 96.39,86.98 96.39,87.11 | 96.39,87.11 IC5.4 | 27.78,76.64 C27.+ 27.79,76.85 29.33,78.39 31.93,78.39 C26.+ | 100.55,21.98 100.57,21.96 C50.+ 101.44,22.82 | IC4.4 29.68,71.34 30.7,71.34 v30.79,71.24 | 32.54,73.75 32.48,73.69 32.48,73.19 IC4.20
  Top 0.254: 34.79,69.34 IC4.13 32.82,69.34 | 30.38,69.34 IC4.8 28.77,69.34 | 96.39,77.46 IC5.25 | v33.75,73.88 32.67,73.88 32.54,73.75
  Top 0.305: 34.79,69.34 v35.13,69.09 | v30.8,69.35 30.38,69.34
  Top 0.406: 96.44,87.16 96.44,87.78 | 95.88,77.97 95.88,78.13 95.91,78.13 v95.91,78.32 | 28.77,69.34 v28.48,69.28 | v30.8,69.35 31.21,69.16 32.22,69.17 32.82,69.34 | 100.5,92.72 100.5,93.52 | v102.14,94 v102.13,94 | C50.+ 100.57,21.92 100.55,21.93 99.44,20.82 IC6.17
  Top 0.61: v98.9,92.16 98.9,91.15 | 96.44,87.78 v96.99,88.35 | v96.38,85.59 96.38,86.21 | 82.25,24.09 82.44,24.28 | 23.46,14.44 X4.2 | 27.66,76.62 27.69,76.65 C27.+ | L4.1 103.57,21.38 103.47,21.55 | 102.46,22.82 101.44,22.82 | 16.76,78.98 J2.4 | 95.88,77.97 96.39,77.46 | 57.05,62 57.02,61.97 v57,61.97
  Top 1.016: 98.6,90.82 100.5,92.72 | R11.2 26.81,73.87 27.78,74.84 27.78,76.64 | 103.47,21.55 102.46,22.82 v102.46,24.35 102.01,24.78 102.01,24.79 | 80.57,22.41 80.55,22.39 | v49.07,67.84 49.07,66.94 51.72,64.29 54.77,64.29 57.05,62 | 100.5,93.52 101,94 v102.14,94
  Top 1.27: v27.62,79.56 v27.62,80.38 | 27.66,76.62 27.62,78.94 v27.62,79.56 | 16.76,78.98 13.75,78.97 10.26,78.97 4.25,72.97 4.25,18.84 8.73,14.44 23.46,14.44 | X4.2 26.96,17.49 62.96,17.49 64.16,18.69 64.16,21.61 64.93,22.38 64.95,22.41 80.57,22.41 82.25,24.09 | 82.44,24.28 82.95,24.79 v89.63,24.79 | v95.03,24.79 102.01,24.79 | v27.62,79.56 27.62,80.25 27.65,80.29 27.65,79.53 v27.62,79.56
  Bottom 0.152: 11.13,72.48 R10.2 | 102.13,92.81 C44.2 | 35.22,73.87 arc60 35.4,73.88 | 36.42,73.88 36.52,73.84 | 27.42,69.39 arc-313 27.38,69.37 C25.1 27.21,69.37 27.29,69.28 | 12.75,66.09 12.63,66.22 R9.2 | 100.68,23.58 C53.1
  Bottom 0.254: 33.62,73.87 33.62,73.81 | 32.54,73.87 32.54,73.88 32.48,73.88 | 34,73.87 34,73.88 v33.75,73.88
  Bottom 0.406: 11.5,64.84 12.75,66.09 | 30.76,73.87 30.76,73.88 30.79,73.85
  Bottom 0.61: v35.13,69.09 35.4,69.3 C24.1 | v30.8,69.35 v30.79,71.24 30.79,73.85 | 16.88,78.97 16.89,78.96 J2.4 | 36.52,73.84 R12.2 36.54,73.87 | 33.62,73.87 34,73.87 | 9.63,64.84 11.5,64.84 | SV1.7 54.43,93.21 SV1.7 | SV1.10 | SV1.9 57.24,93.42 57.24,93.18 | SV1.7 54.32,93.18 | SV1.7 | v102.46,24.35 101.69,23.58 100.68,23.58 | v57,61.97 R69.2 | R69.2 57,58.4 56.99,58.38 | R69.2 57.13,58.45 | R11.2 | v28.48,69.28 27.29,69.28
  Bottom 1.016: v102.13,94 102.13,92.81 | v57,61.97 R69.2 | v96.99,88.35 98.9,88.35 v98.9,92.16 | 34,73.87 35.22,73.87 | 35.4,73.88 36.42,73.88 | R10.2 10.13,71.72 8.38,69.97 8.38,66.09 9.63,64.84 | v49.07,67.84 49.07,68.46 41.24,76.29 38.96,76.29 36.54,73.87 | R11.2 30.76,73.87 32.54,73.87 33.62,73.87 | v95.91,78.32 95.98,78.32
  Bottom 1.27: 11.13,72.48 11.13,77.22 12.88,78.97 15.13,78.97 J2.4 | R11.2 21.98,73.87 16.89,78.96 | SV1.7 51.5,90.22 30.25,90.22 27.63,87.47 v27.63,78.81 | 54.43,93.21 SV1.9 | SV1.9 SV1.10 SV1.8 | 57.24,93.18 63.34,93.18 64.29,92.23 64.29,89.43 | 64.29,89.43 64.29,89.37 | 66.64,76.48 93.76,76.48 95.6,78.32 v95.91,78.32 95.91,80.86 96.38,81.33 v96.38,85.59 | 65.44,77.62 66.58,76.48 66.64,76.48 | v27.62,78.79 27.59,78.77 | v27.62,78.79 v27.62,78.8 | v27.63,78.81 v27.62,78.79 | v27.62,79.56 v27.62,79.55 27.59,79.53 27.63,79.49 v27.63,78.81 | v89.63,24.79 v88.8,24.79 | v88.8,24.79 v87.91,24.79 | v89.63,24.79 v88.8,24.79 | v95.91,24.79 95.98,24.79 | v89.63,24.79 v95.03,24.79 | v95.03,24.79 v95.91,24.79 | v95.03,24.79 v95.91,24.79 | 66.64,76.48 64.29,78.83 64.29,89.43
  pour Top: 29.24,77.37 33.11,77.37 33.24,77.5 33.24,79.4 30.26,79.4 29.11,80.54 28.67,80.99 26.89,80.99 26.26,80.35 26.26,78 26.95,77.3 28.99,77.3 28.8,77.3 29.11,77.3 29.18,77.37
  pour Top: 30.32,69.43 30.51,69.62 31.08,69.62 31.15,69.62 31.34,69.43 31.53,69.24 31.97,69.24 32.35,69.62 32.92,69.62 33.18,69.37 33.18,69.24 32.86,68.92 30.7,68.92 30.38,69.24 30.38,69.3 30.32,69.37
/RD
  Top 0.152: IC1.34 65.63,41.47 67.1,41.47 69.1,43.47 U1.P94
/WR
  Top 0.152: IC1.33 65.63,40.97 67.35,40.97 68.85,42.47 U1.P96
A8
  Top 0.152: IC1.35 65.63,42.47 67.34,42.47 68.84,43.97 U1.P93
A9
  Top 0.152: IC1.36 65.63,43.47 67.61,43.47 69.61,45.47 U1.P90
A10
  Top 0.152: IC1.37 65.63,43.97 67.36,43.97 69.36,45.97 U1.P89
A11
  Top 0.152: IC1.38 65.63,44.97 67.5,44.97 71.5,48.97 U1.P83
A12
  Top 0.152: IC1.39 67.25,45.59 71.13,49.47 U1.P82 72.63,49.47
A13
  Top 0.152: IC1.40 65.92,46.38 69.75,50.22 69.75,51.34 70.88,52.47 U1.P76
A14
  Top 0.152: U1.P75 70.63,52.97 69.25,51.59 69.25,50.34 66.13,47.22 65.63,47.22 65.69,47.17 IC1.41
A15
  Top 0.152: IC1.42 65.63,47.97 66.13,47.97 68.88,50.72 68.88,51.97 70.38,53.47 U1.P74
AD0
  Top 0.152: IC1.51 62,54.84 62,55.22 69.75,62.97 U1.P55
AD1
  Top 0.152: IC1.50 62.88,54.72 62.88,55.22 63.75,56.09 68.25,60.47 U1.P60
AD2
  Top 0.152: IC1.49 63.63,54.97 63.63,55.37 68.23,59.97 U1.P61
AD3
  Top 0.152: IC1.48 65.63,52.47 65.63,54.83 70.26,59.46 70.45,59.46 70.45,59.47 U1.P62
AD4
  Top 0.152: IC1.47 65.63,51.97 66.13,51.97 66.38,52.22 66.38,54.97 70.38,58.97 U1.P63
AD5
  Top 0.152: U1.P64 70.5,58.47 66.88,54.84 66.88,51.72 66.25,51.09 65.63,51.09 65.39,51.11 IC1.46
AD6
  Top 0.152: IC1.45 65.63,50.47 66.38,50.47 67.38,51.47 67.38,54.72 70.63,57.97 71.25,57.97 72.27,57.97 U1.P65
AD7
  Top 0.152: IC1.44 65.63,49.47 66.13,49.47 67.88,51.22 67.88,54.47 69.88,56.47 U1.P68
AGNDAD  (via drill 0.3, 0.3 pad 0.61)
  Top 0.152: X2.1 74.13,97.84 78.5,97.84 81,95.47 82.63,95.47 C34.- 83.75,94.62 v83.75,92.47 | IC5.20 89.88,77.47 v89.37,77.97 89.37,75.97 83.79,70.38 83.79,69.54 | IC5.16 84.88,77.02 84.93,77.3 84.93,77.94 84.9,77.97 v84.37,77.97 84.33,77.97 84.23,78.07 80.8,78.07 80.36,77.63 C40.2 | v84.88,85.97 84.88,87.05 IC5.13 84.96,87.75 86.58,89.37 86.58,90.13 | 83.79,69.54 83.79,69.5 | C41.- 83.79,69.54 | v75.91,87.72 78.26,87.72 v78.33,87.66 | 86.58,90.13 | 86.58,90.13 v86.61,90.09 88.94,90.09 C42.- 92.09,93.12 92.61,93.12 SV2.5 92.61,93.24 92.61,95.72 SV2.6 | SV2.2 87.53,93.12 SV2.1 87.47,92.36 v86.33,91.21
  Top 0.254: v82.01,72.22 83.79,70.45 83.79,70.38
  Bottom 0.152: C38.2 84.63,83.97 84.63,79.23 84.55,79.15 84.53,79.16 C36.2 | C36.2 84.63,79.47 | 86.26,91.22 87.88,91.22 87.88,90.72 87.75,90.59 87.88,90.47 C43.2 v86.61,90.09 | 86.26,91.22 84.75,91.22 83.63,90.97 C39.2 83.63,91.13 | R25.1 90.38,82.59 90.38,84.22 | C37.2 90.38,84.09 | R25.1 90.38,81.72 | C37.2 90.13,84.47 | C37.2 90.63,84.47 | 83.63,91.13 83.63,91.09 | v83.75,92.47 83.63,92.34 83.63,91.13 | C33.1 72.44,86.98 73.25,87.78 75.85,87.78 v75.91,87.72 | v78.33,87.66 79.21,86.77 79.21,85.55 C32.1 82.25,85.51 83.53,84.23 84.55,84.23 84.54,84.22 C38.2 | v84.88,85.97 84.88,85.95 84.53,85.61 C38.2 | 84.56,79.22 84.61,79.27 | 84.56,79.22 C36.2 | 84.56,79.22 84.37,79.03 v84.37,77.97 84.37,77.95 | 90.38,84.22 90.39,84.23 | 90.38,84.22 C37.2 | R25.1 90.36,81.84 90.39,81.81 90.38,81.8 90.38,79.47 C35.2 90,78.73 v89.37,77.97 84.39,77.97 84.37,77.95 | 84.37,77.95 84.36,77.94 | SV2.6 94.01,97.18 96.3,97.18 97.63,95.85 97.63,95.78 | SV2.10 97.63,95.66 | SV2.10 97.63,95.78 | 97.63,95.78 SV2.10 | SV2.9 97.63,95.78 | 86.26,91.22 86.26,91.15 v86.33,91.21
  other vias: 81.82,79.27 73.06,78.32 74.83,75.08
  pour Bottom (isolate 0.152): 67.13,99.59 67.13,83.22 71.38,83.22 71.38,74.42 81,74.42 81,69.3 85.25,69.3 85.25,74.2 91.25,74.2 91.25,88.84 97.75,88.84 97.75,91.83 98.76,92.83 98.76,99.59
  pour Top (rank 5): 71.38,74.42 81,74.42 81,68.1 85.25,68.1 85.25,75.47 91.76,75.47 91.85,88.86 95.09,88.86 95.09,89.37 97.75,89.36 97.75,91.83 97.88,91.96 98.76,92.84 98.75,93.22 98.75,99.34 98.75,99.6 67.13,99.6 67.13,83.22 71.38,83.22
AGNDDA  (via drill 0.3)
  Top 0.152: C52.- 99.63,11.47 99.63,10.47 98.13,8.97 97.64,8.97 | C57.- 91.63,12.47 88.13,12.47 C54.- 87.44,11.65 | 87.44,11.65 87.45,11.6 | 87.47,8.97 97.64,8.97 | 97.64,8.97 97.63,8.96 SV3.10 | SV3.10 | SV3.9 SV3.10 | SV3.1 87.47,5.55 | 87.47,5.55 SV3.2 87.47,6.95 87.47,8.97 | SV3.5 91.28,5.55 87.47,5.55 | 87.44,11.65 87.47,11.65 87.47,8.97 | IC6.9 90.63,17.47 v95.63,17.47 97.63,17.47 IC6.12
  Bottom 0.152: 96.13,15.97 96.13,14.47 C58.2 96.13,13.47 96.13,10.97 97.63,9.47 SV3.10 | 96.13,15.97 96.63,16.47 100.13,16.47 C49.2 | 96.13,15.97 87.63,15.97 C51.2 | SV3.10 | SV3.10 | v95.63,17.47 94.63,17.47 R38.2
  pour Bottom (isolate 0.152): 66.25,0.72 66.25,19.47 101.75,19.47 101.88,19.59 102.75,20.59 104.63,20.59 104.88,20.34 104.88,18.09 102.63,15.85 102.63,0.72
  pour Top (rank 5): 66.25,0.97 66.25,19.47 101.75,19.47 102,19.72 102.75,20.59 104.63,20.59 104.88,20.34 104.88,18.09 102.63,15.85 102.63,0.97
ALE
  Top 0.152: IC1.43 65.88,48.72 66.13,48.72 68.38,50.84 68.38,54.34 70,55.97 U1.P69
AVDDAD  (via drill 0.3)
  Top 0.152: IC5.9 90.13,87.47 v90.13,88.47 90.25,88.6 91.25,89.6 C42.+ 93.13,89.97 | 96.5,90.47 96.63,90.47 L3.1
  Top 0.61: 96.5,90.47 96.49,90.49 96.49,90.51 93.67,90.51 93.13,89.97
  Bottom 0.152: 89.57,90.07 89.58,90.07 C43.1
  Bottom 1.016: v90.13,88.47 89.57,89.03 89.57,90.07
  pour Top (rank 2): 93.38,90.89 94.07,91.59 96.3,91.59 96.36,91.53 96.36,90.2 96.04,89.88 94.84,89.88 94.14,89.18 93.31,89.18 93.19,89.31 93.19,90.7
  pour Top (rank 2): 90.39,87.78 91.53,88.93 91.53,89.05 91.53,89.81 89.76,88.04 89.76,87.72 90.39,87.72
  pour Top (rank 2): 90.71,88.16 94.14,88.16 95.85,89.88 96.04,89.88 95.6,90.32 91.79,90.32 90.64,89.18 90.64,88.35
AVDDDA  (via drill 0.3)
  Top 0.152: v102.63,17.97 102.17,17.96 | 101.63,17.97 C52.+ | 103.13,19.47 L4.2 | IC6.14 97.63,18.97 v96.63,18.97 90.63,18.97 IC6.7 90.13,18.97 88.13,18.97 C54.+ 87.13,17.84
  Top 0.406: 102.17,17.96 101.63,17.97
  Top 0.61: 103.13,19.47 103.13,18.47 v102.63,17.97
  Top 1.016: 87.13,17.84 v85.48,17.84
  Bottom 0.61: v96.63,18.97 97.13,18.47
  Bottom 1.016: v102.63,17.97 101.13,17.97 C49.1 100.13,18.47 97.13,18.47 | v85.48,17.84 C51.1
  pour Top: 102.14,16.6 102.39,16.6 103.79,18 104.3,18.5 104.3,19.01 103.92,19.39 102.52,19.39 102.2,19.08 102.01,19.08 101.57,18.63 101.57,17.04 101.57,16.6
  pour Top (rank 2): 97.44,18.76 96.68,18.38 91.41,18.38 90.96,18.76 90.71,18.76 90.71,18.95 90.77,19.01 97.44,19.01
  pour Top (rank 2): 86.64,18.5 87.15,19.01 89.31,19.01 90.71,19.01 89.12,17.42 89.12,16.98 88.68,16.54 86.71,16.54
CFG_DONE  (via drill 0.3)
  Top 0.152: IC3.13 104.01,29.72 103.6,30.12 99.28,30.12 97.57,28.41 v95.53,28.41 | 83.86,29.06 83.85,29.04 | R13.2 83.86,29.06 | v88.99,28.41 88.1,28.41 87.41,29.11 83.91,29.11 83.86,29.06
  Bottom 0.152: v88.99,28.41 v95.53,28.41
CLK8MHZ
  Top 0.152: JP4.6 JP4.5
  Bottom 0.152: C8.2 58.63,41.47 58.63,38.33 58.64,38.32 58.64,37.81 57.69,36.86 57.69,35.46 57.24,35.01 57.25,35 Q1.1 57.25,33.97 58.13,32.97 R67.2 58.13,32.47 56.13,32.47 R68.1 55.63,32.47 55.63,30.72 53.88,28.96 41.89,28.96 40.54,30.31 40.54,31.39 JP4.6
DONE  (via drill 0.3)
  Top 0.152: IC3.10 102.71,34.25 102.71,35.71 99.6,38.82 v95.41,38.82 93.88,38.82 93.57,39.14 82.96,39.14 82.64,38.82 79.41,38.82 77.88,40.41 77.44,40.86 v77.18,40.86 | v75.41,40.73 75.41,40.03 73.88,38.51 72.55,38.51 72.53,38.49 U1.P104
  Bottom 0.152: v77.18,40.86 75.53,40.86 v75.41,40.73 | R2.1 96.74,38.76 | R2.1 | 96.68,38.82 R2.1
  Bottom 0.61: v95.41,38.82 96.68,38.82
FPGACLK  (via drill 0.3)
  Top 0.152: v51.13,36.33 51.13,40.98 52.12,41.97 60,41.97 61.5,40.47 62.32,40.47 62.32,40.48 62.64,40.48 63.21,41.05 63.21,42.51 v63.78,43.08 | U1.P77 71.13,51.97 70.38,51.22 70.38,50.22 67.72,47.56 v67.72,47.08
  Bottom 0.152: v51.13,36.33 47.61,32.68 44.26,32.68 43.38,33.71 JP4.3 | v67.72,47.08 67.72,47.02 v63.78,43.08
FRST
  Top 0.152: IC1.29 61.13,39.47 61.63,39.97 64.25,39.97 65.25,38.97 66.86,38.97 68.36,40.47 U1.P100
GND  (via drill 0.3, 0.3 pad 0.61)
  Top 0.152: 72.63,47.98 72.63,47.48 U1.P86 72.6,47.47 72.61,47.46 v70.83,47.46 | 72.63,47.98 72.63,48.47 U1.P84 72.6,48.47 72.61,48.48 73.56,48.48 74.13,49.05 74.26,50.95 72.55,50.95 U1.P79 | 72.63,47.98 U1.P85 | v55.63,40.47 55.63,39.47 IC1.22 55.73,39.07 55.72,39.08 55.66,39.01 v55.66,37.94 | v82.13,67.47 82.13,66.47 U1.P37 | v100.63,97.97 100.63,96.97 C45.- | v100.5,90.97 98.57,89.03 96.69,89.03 95.13,87.47 IC5.5 95.13,86.97 95.09,82.77 94.9,82.19 | IC4.18 33,71.84 32.69,71.53 32.69,71.21 | 32.69,71.21 32.69,70.72 32.88,70.53 | 32.88,70.53 33.07,70.34 IC4.15 | 41.38,75.97 41.35,76 D2.A | IC1.53 60.45,54.29 60.44,53.52 v60.44,53.41 | v94.86,75.54 95.13,75.9 IC5.24 95.15,81.43 94.9,82.19 | D2.A 41.85,75.62 41.88,75.34 v41.88,73.97 | U1.P52 74.64,66.08 | SV1.4 49.31,95.72 | SV1.4 SV1.6 SV1.5 | SV1.4 SV1.2 SV1.1 | SV1.1 SV1.3 | C26.- 32.42,81.63 arc-90 32.41,81.62 30.89,81.62 29.68,83.4 C27.- 26.63,83.47 22.76,83.47 C28.- 21.05,83.4 20.48,84.04 16.92,84.04 J2.3 16.86,89.12 J2.2 | LED2.C | LED2.C 7.02,63.4 7.02,62.25 8.1,61.37 Q4.2 12.35,61.37 | 12.35,61.37 v12.48,61.37 12.35,61.37 | v16.35,61.37 17.43,61.37 18.25,60.41 19.84,60.35 C13.- 17.18,57.68 17.18,48.6 18.57,47.21 v25.24,47.21 | 32.69,71.21 32.67,71.21 IC4.TGND1 | 32.88,70.53 32.35,70 IC4.TGND2 31.02,70.01 30.62,70.34 IC4.6 29.66,70.32 28.41,70.32 v28.29,70.45 | X4.10 34.07,14.44 | X4.6 | X4.4 | 102.71,28.85 IC3.11 | 102.71,28.85 C50.- 99.72,26.93 | 99.72,26.93 99.03,26.93 99.03,26.95 | 94.9,82.19 v94.88,82.22 | SV4.18 118.46,68.29 107.34,68.35 U1.P208 | U1.P208 | 52.61,54.45 IC1.63 52.55,54.51 52.55,53.68 v53.12,53.11 | v118.39,23.14 118.52,23.01 123.28,23.01
  Top 0.152: 102.71,28.85 102.2,29.36 v100.93,29.36 | v100.87,33.05 100.87,34.51 100.23,35.14 100.23,36.35 100.21,36.35 U1.P156 100.17,37.17 99.66,37.68 v98.84,37.68 | 87.15,66.13 U1.P27 | C12.- 33.3,53.67 33.3,53.75 30.19,53.75 | 30.19,53.75 28.99,54.95 v28.99,58.64 | R4.1 33.3,65.49 34,65.49 36.03,63.46 36.03,59.91 v37.24,58.7 | U1.P173 102.37,46.51 104.62,46.51 105.31,47.21 v105.31,47.27 | 92.17,66.11 U1.P17 | 92.3,60.54 v92.23,60.6 | U1.P208 101.76,64.54 101.76,65.49 105.63,69.37 v105.88,69.37 | v106.01,72.73 106.08,72.8 v106.08,81.18 | U1.P208 102.39,64.03 102.39,64.92 105.44,67.97 105.82,67.97 107.73,69.88 v112.93,69.88 | 123.22,43.57 123.22,43.46 | SW1.16 123.22,43.57 | v126.4,49.75 123.22,46.57 123.22,43.57 | 99.72,26.93 99.72,26.95 98.07,26.95 v97.25,26.12 | 30.19,49.11 30.19,53.75 | 30.19,49.11 30.19,48.86 | JP3.10 | 30.19,49.11 30.19,47.93 R20.1 29.49,47.21 v30.96,47.21 | 11.33,35.33 11.33,35.37 X6.G2 | v45.94,65.43 45.94,62.76 46.45,62.25 46.96,62.25 | IC6.16 97.98,20.15 99.47,20.15 99.72,19.9 v100.04,19.9 | SV1.1 46.83,88.1 48.16,86.77 48.16,84.29 48.1,84.29 X5.10 | 7,68.93 LED1.C 7.02,68.92 7,68.93 | 7,68.93 LED4.C | 7,63.45 6.95,63.4 | LED2.C 7,63.45 | LED2.C 7,63.45 | LED2.C 7.02,64.22 7.65,64.86 8.03,64.86 8.41,65.24 8.41,66.95 7.97,67.4 7.59,67.4 7,67.98 7,68.93 | v42.19,58.51 43.21,58.51 46.96,62.25 | D2.A 41.39,76.02 41.43,75.97 v41.43,80.29 | U1.P95 72.48,43.02 | U1.P95 | v74.39,42.95 72.55,42.95 U1.P95 | v79.21,41.68 79.28,41.74 | v81.75,60.54 81.69,60.6 | 57.88,35.71 v57.05,35.71 | 57.88,35.71 58.01,35.71 | v58.96,35.65 58.89,35.71 57.88,35.71 | v59.21,26.95 60.42,28.16 v60.42,30.82 | v41.37,71.84
  Top 0.152: D1.A 18.38,71.53 v21.05,71.53 | v50.83,61.05 50.83,61.24 49.81,62.25 46.96,62.25 | X4.8
  Top 0.254: v34.38,29.22 34.32,29.16 33.13,29.16 33.06,29.23 IC2.14 | v78.07,34.82 74.96,34.82 74.71,35.08 74.71,36.29 U1.P105 | 82.71,37.68 82.71,36.35 U1.P121 82.71,36.29 82.71,35.33 82.2,34.82 v80.87,34.82 | U1.P70 73.75,55.46 74.39,56.1 v74.39,56.16 | 82.71,37.68 83.47,38.44 85.12,38.44 85.95,37.62 v87.72,37.62 | U1.P52 74.68,66.09 74.71,66.07 74.64,66 | v75.79,70.64 74.64,69.5 | 87.72,36.36 U1.P131 87.66,36.34 87.66,37.55 v87.72,37.62 | v92.42,37.68 92.36,37.62 v87.72,37.62 | 82.71,37.68 82.64,37.62 v81.31,37.62 | U1.P27 87.21,66.12 arc90 87.22,66.13 arc90 87.15,66.07 v87.15,61.24 | X6.G2 11.3,29.65 12.58,28.37 | 12.58,28.37 X6.5 | v18.38,28.28 12.67,28.28 12.58,28.37 | v32.73,41.74 32.73,41.81 26.26,35.33 11.33,35.33 | X4.4 26.51,14.38 25.18,13.04 22.83,13.04 20.28,10.5 18.32,10.5 | X4.6 29.11,14.38 31.72,14.38 31.66,14.43 X4.8 | X4.6 | X4.4 X4.6 | X4.10 34.26,14.31 | X4.10 | X4.10 32.99,15.58 v32.99,15.84 X4.8 | X4.8 | JP3.1 JP3.3 JP3.5 | JP3.5 | JP3.6 JP3.5 | JP3.6 JP3.4 | JP3.4 46.77,14.44 | JP3.2 44.29,14.44 JP3.4 | JP3.6 49.81,14.44 51.08,13.17 54.45,13.17 | 54.45,13.17 54.45,11.84 | JP3.10 54.45,13.17 | 32.39,81.65 32.35,81.69 | 32.39,81.65 C26.- | v34.32,79.53 34.32,79.72 32.39,81.65 | v34.51,75.08 34.57,75.02 37.62,75.02 38.38,74.26 38.38,71.84 | 38.38,71.84 IC4.18 | 41.43,71.84 v41.37,71.84 38.38,71.84 | X6.G1 11.32,10.36 11.46,10.5 18.32,10.5 | 18.32,10.5 19.65,9.17 v20.22,9.17 | v77.82,57.49 v77.82,59.59 78.26,60.03 v78.26,60.6 78.33,60.54 v81.75,60.54 | v81.75,60.54 81.82,60.54 | U1.P37 82.2,66.1 82.2,65.11 82.39,64.92 82.39,60.73 82.2,60.54 v81.75,60.54
  Top 0.305: IC6.16 97.95,20.15 97.19,20.15 96.93,20.41 96.93,20.73 96.55,21.11 v96.04,21.11 | U1.P198 100.95,58.97 v100.93,58.95 | U1.P141 92.68,37.42 v92.42,37.68 | U1.P188 103.95,53.97 v104.17,53.75 | v104.17,51.21 103.93,50.97 U1.P182 101.01,50.97 v101,50.95 | 92.3,60.54 92.3,60.03 91.53,59.27 | 90.2,59.21 v90.2,59.27 | 94.07,59.14 v94.14,59.14 94.2,59.08 96.55,59.08 96.61,59.02 v96.61,59.08 | 94.07,59.14 94.14,59.08 | U1.P10 95.68,63.19 96.68,62.19 v96.68,60.48 96.61,60.41 v96.61,59.08 | v96.61,59.08 96.68,59.02 96.55,58.89 | 90.2,59.21 90.2,57.24 89.19,56.22 v88.04,56.22 | v82.2,56.22 82.2,56.16 82.14,56.22 v79.09,56.22 77.88,56.22 arc90 77.82,56.16 | v96.55,57.43 96.55,59.02 v96.61,59.08 | v92.17,62.7 92.17,66.11 | 90.2,59.21 arc-90 90.26,59.27 91.53,59.27 | 94.07,59.14 93.95,59.27 91.53,59.27
  Top 0.406: 114.71,3.83 114.84,3.9 | 114.71,3.83 JP1.3 114.76,3.83 116.76,3.83 | JP1.1 112.71,3.83 114.71,3.83 | 116.76,3.83 116.81,3.83 | 118.76,3.83 118.84,3.83 | 116.76,3.83 JP1.5 | 118.76,3.83 116.76,3.83 | 120.76,3.83 120.81,3.83 | 118.76,3.83 JP1.7 | 120.76,3.83 118.76,3.83 | 120.76,3.83 JP1.9 | 120.76,3.83 122.71,3.83 JP1.11 122.76,3.83 124.74,3.83 124.81,3.78 JP1.13 | v81.31,41.68 v79.21,41.68 78.58,41.68 78,42.26 v78,42.88 v78.01,42.89 78.07,42.95 77.75,43.27 | SW1.15 123.31,41.09 123.35,41.05 | SW1.15 SW1.16 | SW1.15 123.31,38.61 123.35,38.57 SW1.14 SW1.13 | SW1.13 123.31,35.99 123.28,35.97 | SW1.12 123.31,33.45 123.28,33.43 | SW1.12 SW1.13 | SW1.11 123.31,30.91 123.28,30.89 | SW1.11 SW1.12 | SW1.11 123.31,28.43 123.28,28.41 SW1.10 123.31,25.89 123.28,25.87 SW1.9 123.31,25.91 123.28,25.93 123.28,23.01 123.28,21.11 123.18,21.01 JP2.8 | v77.82,57.49 77.82,56.16 v77.82,54.89 77.75,54.89 78.07,54.57 v78.07,46.63 | v78.07,46.63 78.01,46.57 | v78.07,46.63 78.01,46.7 78,46.69 | 77.75,45.43 78.07,45.75 v78.07,46.63
  Bottom 0.152: C14.2 34.28,29.12 | C14.2 31.63,29.16 | C14.2 31.63,25.09 30.72,24.18 C7.1 30.26,24.16 32.92,21.11 v32.99,15.84 | 102.28,90.97 102.25,90.97 | 102.28,90.97 C44.1 102.32,88.23 102.33,88.23 105,85.56 | 102.28,90.97 v100.5,90.97 100.49,90.99 100.49,96.1 | 102.28,90.97 102.13,91.09 | v55.63,40.47 55.38,40.72 55.38,42.72 | 52,43.53 C2.1 52,43.55 52.04,43.52 52.04,47.4 52.93,48.29 | R66.1 56.99,50 | C29.2 61.25,50.03 61.35,49.94 67.4,49.94 v70.83,47.46 | C29.2 60.53,50.62 59.75,51.34 | 59.75,51.34 59.75,52.66 60.32,53.22 60.5,53.47 v60.44,53.41 | v41.88,73.97 41.67,73.76 C11.1 40.61,73.75 40.61,72.41 40.42,72.22 | 55.38,42.72 55.97,43.14 C1.1 56.48,43.55 56.48,43.52 58.71,43.52 C8.1 58.77,43.58 58.77,43.59 60.99,43.59 C22.2 61.02,43.59 61.05,43.59 61.24,43.78 C29.2 | v21.05,71.53 25.56,71.59 C10.1 25.49,69.37 | 40.42,72.22 39.78,71.59 C9.1 38.83,69.37 C24.2 38.89,69.31 38.89,69.24 42.13,69.24 v45.94,65.43 | 105,85.56 105,83.91 105,83.9 v105,83.84 105.06,83.79 105.06,82.19 v106.08,81.18 | 105,85.56 107.66,85.56 112.74,90.64 118.01,90.64 118,90.63 SV4.1 | 100.55,21.74 C53.2 100.55,21.74 | 100.55,21.74 98.52,23.58 97.31,24.6 97.25,24.66 v97.25,26.12 | v94.88,82.22 92.99,82.19 92.04,81.81 R25.2 | X5.2 | X5.2 | X5.2 52.41,78.44 R75.1 46.96,81.3 46.83,81.3 44.61,81.36 | 44.61,81.36 44.04,81.37 42.51,81.37 v41.43,80.29 | 55.38,42.72 55.36,42.7 | 59.75,51.34 58.2,50 56.99,49.94 | 56.99,49.94 R66.1 | C20.2 76.66,54.78 | v18.38,28.28 20.22,26.44 v20.22,9.17 | C21.2 108.68,29.15 108.68,27.39 112.93,23.14 v118.39,23.14 | C21.2 106.39,31.36 106.39,31.27 106.46,31.33 106.52,31.33 106.46,31.39